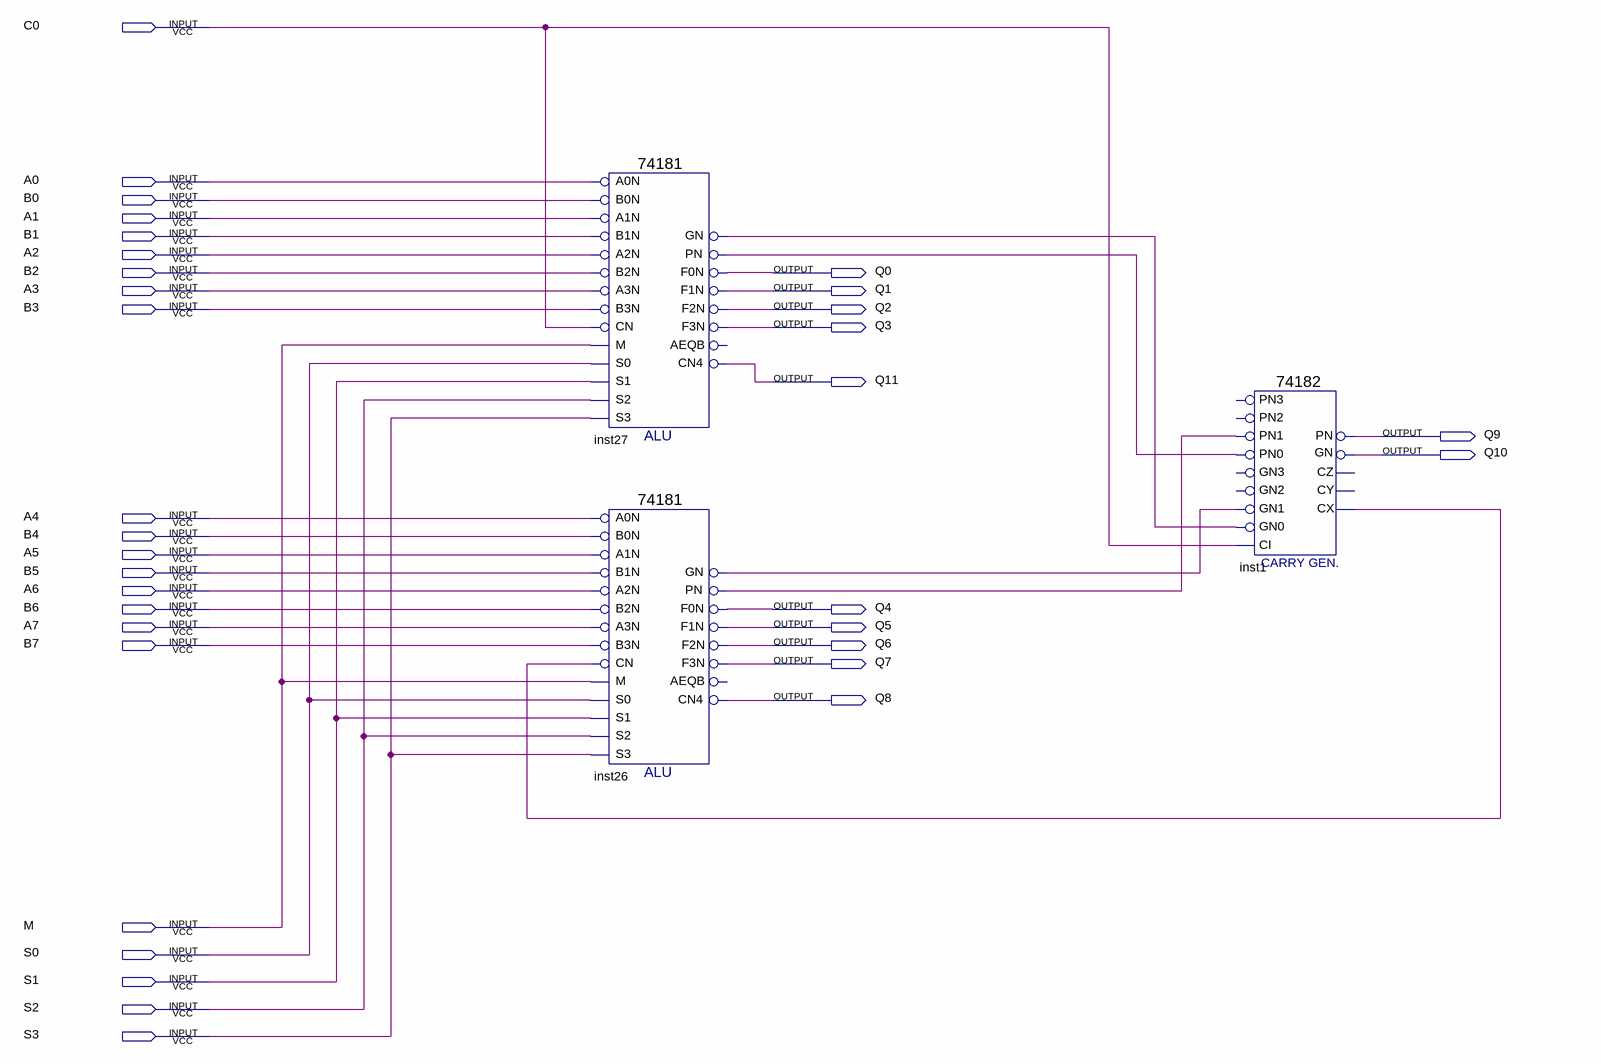
[diagram p0: schematic sheet]
// Quartus schematic ALU-8.bdf as structural Verilog: 3 symbols, 34 pins
module \ALU-8  (
  input  C0,
  input  A0,
  input  B0,
  input  A1,
  input  B1,
  input  A2,
  input  B2,
  input  A3,
  input  B3,
  input  A4,
  input  B4,
  input  A5,
  input  B5,
  input  A6,
  input  B6,
  input  A7,
  input  B7,
  input  M,
  input  S0,
  input  S1,
  input  S2,
  input  S3,
  output Q0,
  output Q1,
  output Q2,
  output Q3,
  output Q11,
  output Q9,
  output Q10,
  output Q4,
  output Q5,
  output Q6,
  output Q7,
  output Q8
);

  wire inst1_cx, inst26_gn, inst26_pn, inst27_gn, inst27_pn;

  \74181  inst27 (
    .B0N(B0), .A0N(A0), .A1N(A1), .B1N(B1), .A3N(A3), .B2N(B2), .A2N(A2), .M(M), .CN(C0), .B3N(B3), .S2(S2),
    .S1(S1), .S0(S0), .S3(S3), .PN(inst27_pn), .GN(inst27_gn), .F3N(Q3), .F1N(Q1), .F0N(Q0), .CN4(Q11),
    .F2N(Q2));  // open: AEQB
  \74181  inst26 (
    .B0N(B4), .A0N(A4), .A1N(A5), .B1N(B5), .A3N(A7), .B2N(B6), .A2N(A6), .M(M), .CN(inst1_cx), .B3N(B7),
    .S2(S2), .S1(S1), .S0(S0), .S3(S3), .PN(inst26_pn), .GN(inst26_gn), .F3N(Q7), .F1N(Q5), .F0N(Q4),
    .CN4(Q8), .F2N(Q6));  // open: AEQB
  \74182  inst1 (
    .CI(C0), .PN1(inst26_pn), .PN0(inst27_pn), .GN1(inst26_gn), .GN0(inst27_gn), .PN(Q9), .CX(inst1_cx),
    .GN(Q10));  // open: PN2, GN2, GN3, PN3, CY, CZ
endmodule
